# Altium schematic sheet Raspberry.SchDoc: Raspberry PI
size A4; Date: 10.11.2025; Author: Alexander Schiechtl; Revision: v1.1; SheetNumber: 3; SheetTotal: 7; Project: 3D-Scanner; SPICEModelCacheFICJDGAN: <root> / <DocumentId>FICJDGAN</DocumentId> / </root>
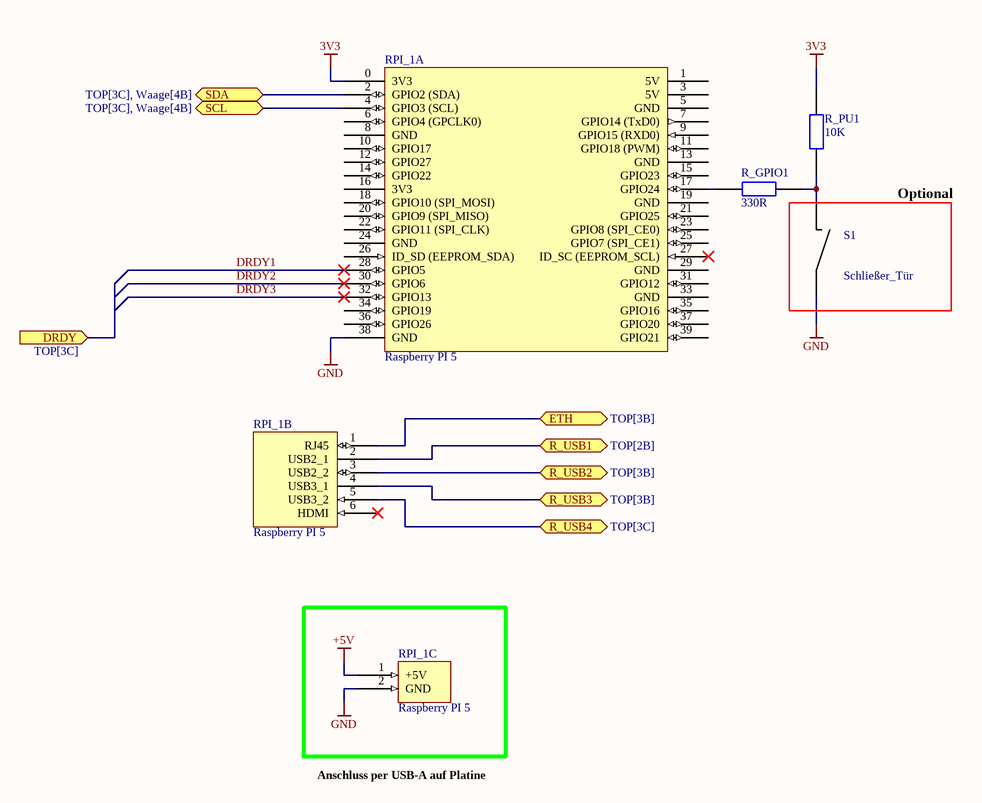
[diagram p0: Raspberry.SchDoc]

## Parts
(Parts that share a designator on the sheet are numbered #1, #2 ... from top to bottom, then left to right.)
R_GPIO1  330R
R_PU1  10K
RPI_1#1  Raspberry PI 5  (parts A,B of 2)
RPI_1#2  Raspberry PI 5  (part C of 3)
S1  Schließer_Tür

## Blocks framed on the sheet
Optional: S1

## Ports
DRDY (in, see TOP[3C]), ETH (bidir, see TOP[3B]), R_USB1 (bidir, see TOP[2B]), R_USB2 (bidir, see TOP[3B]), R_USB3 (bidir, see TOP[3B]), R_USB4 (bidir, see TOP[3C]), SCL (bidir, see TOP[3C], Waage[4B]), SDA (bidir, see TOP[3C], Waage[4B])

## Nets
3V3: R_PU1.1 RPI_1#1.0(3V3)
+5V: RPI_1#2.1(+5V)
GND: RPI_1#1.38(GND) RPI_1#2.2(GND)
DRDY1: RPI_1#1.28(GPIO5)
DRDY2: RPI_1#1.30(GPIO6)
DRDY3: RPI_1#1.32(GPIO13)
ETH: RPI_1#1.1(5V) ; port ETH
R_USB1: RPI_1#1.2(USB2_1) ; port R_USB1
R_USB2: RPI_1#1.3(5V) ; port R_USB2
R_USB3: RPI_1#1.4(USB3_1) ; port R_USB3
R_USB4: RPI_1#1.5(GND) ; port R_USB4
SCL: RPI_1#1.4(GPIO3_(SCL)) ; port SCL
SDA: RPI_1#1.2(GPIO2_(SDA)) ; port SDA
NetR_GPIO1_0: R_GPIO1.0 R_PU1.0
NetR_GPIO1_1: R_GPIO1.1 RPI_1#1.17(GPIO24)

Not connected (* = marked no-connect by the designer): RPI_1#1 6(GPIO4_(GPCLK0)) 7(GPIO14_(TxD0)) 8(GND) 9(GPIO15_(RXD0)) 10(GPIO17) 11(GPIO18_(PWM)) 12(GPIO27) 13(GND) 14(GPIO22) 15(GPIO23) 16(3V3) 18(GPIO10_(SPI_MOSI)) 19(GND) 20(GPIO9_(SPI_MISO)) 21(GPIO25) 22(GPIO11_(SPI_CLK)) 23(GPIO8_(SPI_CE0)) 24(GND) 25(GPIO7_(SPI_CE1)) 26(ID_SD_(EEPROM_SDA)) 27(ID_SC_(EEPROM_SCL))* 29(GND) 31(GPIO12) 33(GND) 34(GPIO19) 35(GPIO16) 36(GPIO26) 37(GPIO20) 39(GPIO21)

## Notes on the sheet
- Anschluss per USB-A auf Platine
- Project:
- Title:
- Leitner AG
- Zona Artigianale Est 7
- 39040 Racines BZ
- Italy
- Confidential
- Author:
- Document name:
- Date:
- Version:
- Size:
- A4

## Library data of the parts
R_GPIO1 = R 330: Widerstand: 330R
R_PU1 = R 10K: Widerstand: 10K
RPI_1#1 = Raspberry PI
RPI_1#2 = Raspberry PI: Versorgung, USB-C
S1 = S_Schließer